# Altium schematic sheet Main.SchDoc
size A4
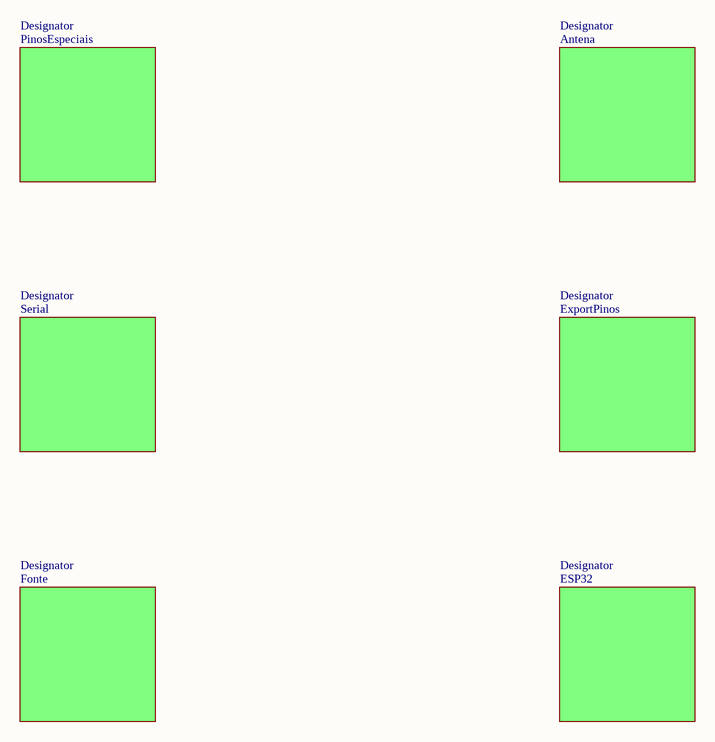
[diagram p0: Main.SchDoc]

## Sub-sheets
Designator = Serial: no entries
Designator = Fonte: no entries
Designator = PinosEspeciais: no entries
Designator = ESP32: no entries
Designator = ExportPinos: no entries
Designator = Antena: no entries